# Altium schematic sheet 3.3V.SchDoc
size A
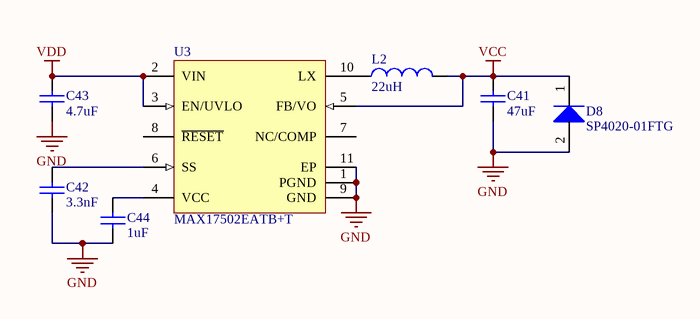
[diagram p0: 3.3V.SchDoc]

## Parts
C41  47uF  [CAPC1210(3225)280_L]
C42  3.3nF  [CAPC0402(1005)60_M]
C43  4.7uF  [CAPC1210(3225)210_L]
C44  1uF  [CAPC0402(1005)60_L]
D8  SP4020-01FTG  [SOD323]
L2  value 22uH  [SDR0604]  (hidden comment: SDR0805-180ML)
U3  MAX17502EATB+T  [MAXM-T1032N+1_V]

## Nets
GND: C41.1 C42.1 C43.1 C44.1 D8.2(A) U3.1(PGND) U3.9(GND) U3.11(EP)
VCC: C41.2 D8.1(K) L2.2 U3.5(FB/VO)
VDD: C43.2 U3.2(VIN) U3.3(EN/UVLO)
NetC42_2: C42.2 U3.6(SS)
NetC44_2: C44.2 U3.4(VCC)
NetL2_1: L2.1 U3.10(LX)

Not connected (* = marked no-connect by the designer): U3 7(NC/COMP) 8(~{RESET})

## Library data of the parts
C41 = CMP-1038-02290-1: CAP 47uF 6.3V ±10% 1210 (3225 Metric) Thickness 2.8mm SMD; Case-Metric: 3225; Case-EIA: 1210; Tolerance: Â±10%; Max Thickness: 2.8 mm; Technology: SMT; Value: 47uF; Rated Voltage: 6.3 V
C42 = CMP-1034-01765-1: CAP 3.3nF 6.3V ±5% 0402 (1005 Metric) Thickness 0.6mm SMD; Case-EIA: 0402; Tolerance: Â±5%; Case-Metric: 1005; Value: 3.3nF; Rated Voltage: 6.3 V; Max Thickness: 0.6 mm; Technology: SMT
C43 = CMP-1038-02103-1: CAP 2.2uF 100V ±10% 1210 (3225 Metric) Thickness 2.1mm SMD; Case-Metric: 3225; Case-EIA: 1210; Tolerance: Â±10%; Rated Voltage: 100 V; Value: 2.2uF; Max Thickness: 2.1 mm; Technology: SMT
C44 = CMP-1034-02113-1: CAP 1uF 6.3V ±10% 0402 (1005 Metric) Thickness 0.6mm SMD; Case-Metric: 1005; Case-EIA: 0402; Tolerance: Â±10%; Value: 1uF; Technology: SMT; Rated Voltage: 6.3 V; Max Thickness: 0.6 mm
D8 = SP4020-01FTG: PartNumber: MMSZ5262BT1G; Manufacturer: On Semiconductor; P Max (W): 0.5; Packing: Tape and Reel; VZ Typ (V): 51; PackageVersion: Rev. G, 10/2009; ComponentLink3Description: Package Specification; PackageReference: SOD-123-2-425-04; PackageDescription: 2-Pin SOD, Body 1.6 x 2.69 mm; ComponentLink1Description: Manufacturer URL; ComponentLink2Description: Datasheet; DatasheetVersion: Rev. 12; Mounting Technology: Surface Mount; RoHS: Pb-Free; ComponentLink1URL: http://www.onsemi.com/; ComponentLink3URL: http://www.onsemi.com/pub_link/Collateral/425-04.PDF; ComponentLink2URL: http://www.onsemi.com/pub_link/Collateral/MMSZ5221BT1-D.PDF
L2 = SDR0805-180ML: Inductor; Code_IEC: 1005; Published: 8-Jun-2000; LatestRevisionDate: 29-May-2009; LatestRevisionNote: IPC-7351 Footprint Added.; PackageReference: 0402-A; Publisher: Altium Limited; PackageDescription: Chip Inductor; Code_JEITA: 0402
U3 = CMP-1264-00005-1: Ultra-Small, High-Efficiency, Synchronous Step-Down DC-DC Converter, 4.5 to 60 V, 1 A, -40 to 125 degC, 10-Pin TDFN (T1032N+1), RoHS, Tape and Reel; Manufacturer: Maxim; IOUT: 1 A Max.; DC-DC Outputs: 1; VCC: 4.65 to 5.35 V; IEN: 8 nA Typ.; VOUT: 3.3 V; FSW: 600 KHz Typ.; Packing: Tape and Reel; PackageDescription: 10-Pin TDFN, Body 3 x 2 mm, Pitch 0.5 mm; ComponentLink3Description: Package Specification; ComponentLink2URL: http://datasheets.maximintegrated.com/en/ds/MAX17502.pdf; Operating Temperature Range: -40 to 125 degC; ComponentLink2Description: Datasheet; ComponentLink1URL: http://www.maximintegrated.com/en.html; Mounting Technology: Surface Mount; ComponentLink3URL: http://pdfserv.maximintegrated.com/package_dwgs/21-0429.PDF; PartNumber: MAX17502EATB+T; VIN: 4.5 to 60 V; PackageVersion: Rev. C; RoHS: TRUE; DatasheetVersion: Rev. 2; ComponentLink1Description: Manufacturer URL